# EAGLE design Adafruit MatrixPortal S3 (EAGLE 9.6.2)
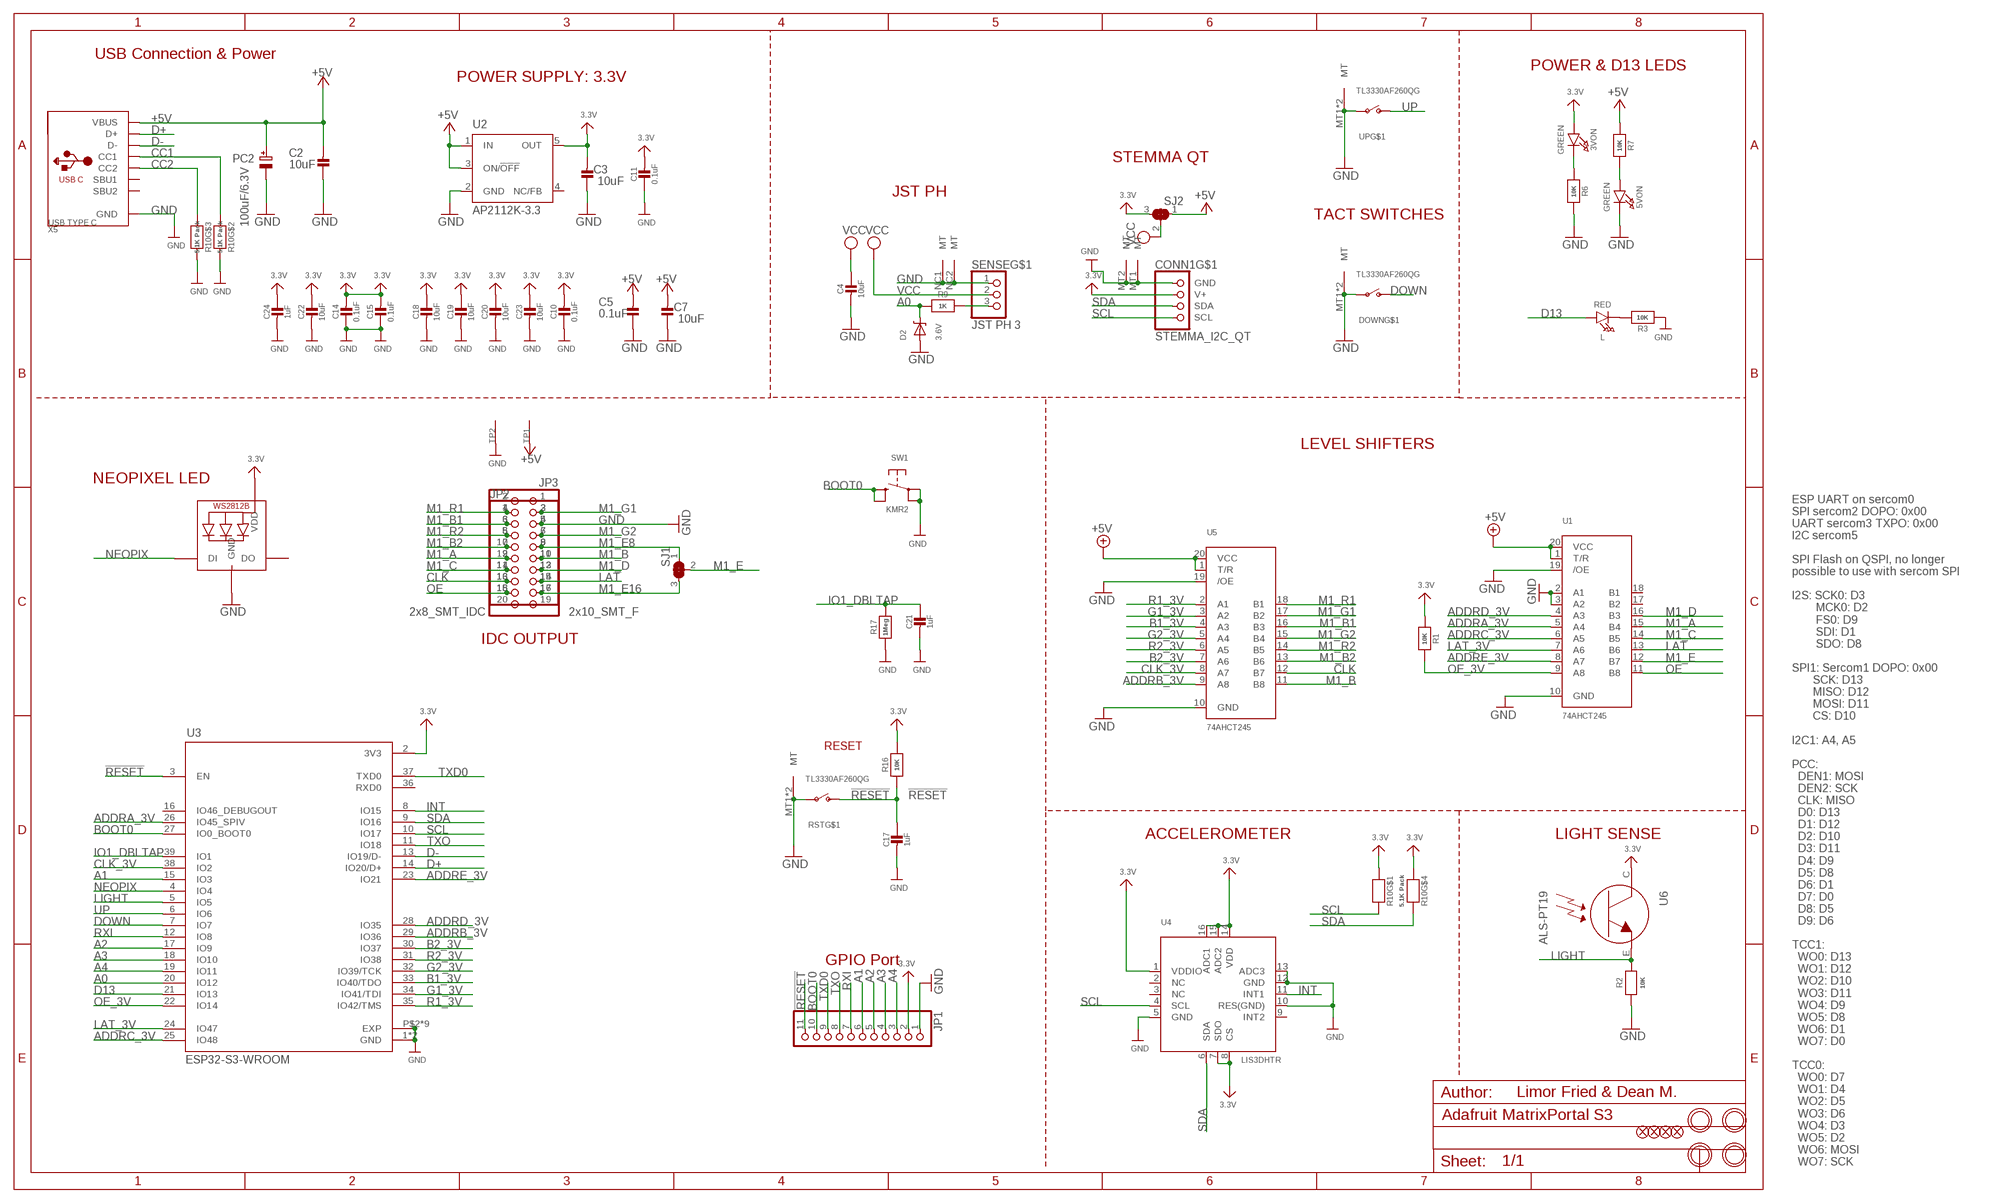
[diagram p0: schematic, sheet 1]

## Parts
3VON  GREEN  LED0603_NOOUTLINE  [CHIPLED_0603_NOOUTLINE]
5VON  GREEN  LED0603_NOOUTLINE  [CHIPLED_0603_NOOUTLINE]
C2  10uF  CAP_CERAMIC0805-NOOUTLINE  [0805-NO]
C3  10uF  CAP_CERAMIC0805-NOOUTLINE  [0805-NO]
C4  10uF  CAP_CERAMIC0805-NOOUTLINE  [0805-NO]
C5  0.1uF  CAP_CERAMIC0603_NO  [0603-NO]
C7  10uF  CAP_CERAMIC0805-NOOUTLINE  [0805-NO]
C10  0.1uF  CAP_CERAMIC0603_NO  [0603-NO]
C11  0.1uF  CAP_CERAMIC0603_NO  [0603-NO]
C14  0.1uF  CAP_CERAMIC0603_NO  [0603-NO]
C15  0.1uF  CAP_CERAMIC0603_NO  [0603-NO]
C17  1uF  CAP_CERAMIC0603_NO  [0603-NO]
C18  10uF  CAP_CERAMIC0805-NOOUTLINE  [0805-NO]
C19  10uF  CAP_CERAMIC0805-NOOUTLINE  [0805-NO]
C20  10uF  CAP_CERAMIC0805-NOOUTLINE  [0805-NO]
C21  1uF  CAP_CERAMIC0603_NO  [0603-NO]
C22  10uF  CAP_CERAMIC0805-NOOUTLINE  [0805-NO]
C23  10uF  CAP_CERAMIC0805-NOOUTLINE  [0805-NO]
C24  1uF  CAP_CERAMIC0603_NO  [0603-NO]
CONN1  STEMMA_I2C_QT  [JST_SH4]
D2  3.6V  DIODE-ZENERSOD323  [SOD-323]
DOWN  TL3330AF260QG  SWITCH_SPST_MNT_TACT_RA  [SPST_TACTILE_RA]
FID1  FIDUCIAL_1MM  [FIDUCIAL_1MM]
FID2  FIDUCIAL_1MM  [FIDUCIAL_1MM]
FID3  FIDUCIAL_1MM  [FIDUCIAL_1MM]
FID4  FIDUCIAL_1MM  [FIDUCIAL_1MM]
JP1  HEADER-1X11  [1X11_ROUND]
JP2  2x8_SMT_IDC  HEADER-2X8_SHROUDEDSMT  [2X08_SHROUDEDSMT]
JP3  2x10_SMT_F  HEADER-2X10SMT_FEMALE  [2X10_SMT_FEMALE]
L  RED  LED0603_NOOUTLINE  [CHIPLED_0603_NOOUTLINE]
LED1  WS2812B_3535FULL  [LED3535_FULLPADS]
PC2  100uF/6.3V  CAP_ELECTROLYTICPANASONIC_D  [PANASONIC_D]
R1  10K  RESISTOR_0603_NOOUT  [0603-NO]
R2  10K  RESISTOR_0603_NOOUT  [0603-NO]
R3  10K  RESISTOR_0603_NOOUT  [0603-NO]
R6  10K  RESISTOR_0603_NOOUT  [0603-NO]
R7  10K  RESISTOR_0603_NOOUT  [0603-NO]
R9  1K  RESISTOR_0603_NOOUT  [0603-NO]
R10  5.1K Pack  RESISTOR_4PACK  [RESPACK_4X0603]
R16  10K  RESISTOR_0603_NOOUT  [0603-NO]
R17  1Meg  RESISTOR_0603_NOOUT  [0603-NO]
RST  TL3330AF260QG  SWITCH_SPST_MNT_TACT_RA  [SPST_TACTILE_RA]
SENSE  JST PH 3  CON_JST_PH_3PIN  [JSTPH3]
SJ1  SOLDERJUMPER_2WAY  [SOLDERJUMPER_2WAY_OPEN_NOPASTE]
SJ2  SOLDERJUMPER_2WAY  [SOLDERJUMPER_2WAY_OPEN_NOPASTE]
SW1  KMR2  SWITCH_TACT_SMT_RKB2  [BTN_RKB2_4.6X2.8]
TP1  SEWTAP_SMTNUTM3  [SMT_NUT_3MM]
TP2  SEWTAP_SMTNUTM3  [SMT_NUT_3MM]
U1  74AHCT245  74LCX245_TSSOP20  [TSSOP20]
U2  AP2112K-3.3  LP2985-XXDBVR33  [SOT23-DBV]
U3  ESP32-S3-WROOM  [S3-WROOM32]
U4  LIS3DHTR  ACCEL_LIS3DHTR  [LGA16_3X3MM]
U5  74AHCT245  74LCX245_TSSOP20  [TSSOP20]
U6  ALS-PT19  PHOTOTRANSISTOR_PT19-315C  [ALS-PT19-315C]
U$14  MOUNTINGHOLE2.5  [MOUNTINGHOLE_2.5_PLATED]
U$19  MOUNTINGHOLE2.5  [MOUNTINGHOLE_2.5_PLATED]
U$22  MOUNTINGHOLE2.5  [MOUNTINGHOLE_2.5_PLATED]
U$24  MOUNTINGHOLE2.5  [MOUNTINGHOLE_2.5_PLATED]
UP  TL3330AF260QG  SWITCH_SPST_MNT_TACT_RA  [SPST_TACTILE_RA]
X5  USB TYPE C  USB_C  [USB_C_CUSB31-CFM2AX-01-X]

## Nets
3.3V: 3VON.A C3.2 C10.2 C11.2 C14.2 C15.2 C18.1 C19.1 C20.1 C22.1 C23.1 C24.1 CONN1.2(V+) JP1.2 LED1.2(VDD) R1.1 R10.1 R10.4 R16.2 SJ2.3 U2.5(OUT) U3.2(3V3) U4.1(VDDIO) U4.7(SDO) U4.8(CS) U4.14(VDD) U4.15(ADC2) U4.16(ADC1) U6.C
!RESET: C17.1 JP1.11 R16.1 RST.2(S) U3.3(EN)
+5V [usbvcc]: C2.2 C5.2 C7.2 PC2.+ R7.1 SJ2.1 TP1.P$1(SEW) U1.1(T/R) U1.20(VCC) U2.1(IN) U2.3(ON/!OFF) U5.1(T/R) U5.20(VCC) X5.A4B9(VBUS) X5.B4A9(VBUS)
A0: D2.C R9.2 U3.20(IO12)
A0_JST: R9.1 SENSE.3
A1: JP1.6 U3.15(IO3)
A2: JP1.5 U3.17(IO9)
A3: JP1.4 U3.18(IO10)
A4: JP1.3 U3.19(IO11)
ADDRA_3V: U1.5(A4) U3.26(IO45_SPIV)
ADDRB_3V: U3.29(IO36) U5.9(A8)
ADDRC_3V: U1.6(A5) U3.25(IO48)
ADDRD_3V: U1.4(A3) U3.28(IO35)
ADDRE_3V: U1.8(A7) U3.23(IO21)
B1_3V: U3.33(IO40/TDO) U5.4(A3)
B2_3V: U3.30(IO37) U5.7(A6)
BOOT0: JP1.10 SW1.B'(S1) SW1.B(S) U3.27(IO0_BOOT0)
CC1: R10.2 X5.A5(CC1)
CC2: R10.3 X5.B5(CC2)
CLK: JP2.13 JP3.16 U5.12(B7)
CLK_3V: U3.38(IO2) U5.8(A7)
D13: L.A U3.21(IO13)
D+: U3.14(IO20/D+) X5.A6(D+) X5.B6(D+)
D-: U3.13(IO19/D-) X5.A7(D-) X5.B7(D-)
DOWN: DOWN.2(S) U3.7(IO7)
G1_3V: U3.34(IO41/TDI) U5.3(A2)
G2_3V: U3.32(IO39/TCK) U5.5(A4)
GND [lowpower]: 5VON.C C2.1 C3.1 C4.2 C5.1 C7.1 C10.1 C11.1 C14.1 C15.1 C17.2 C18.2 C19.2 C20.2 C21.2 C22.2 C23.2 C24.2 CONN1.1(GND) CONN1.MT1(MT) CONN1.MT2(MT) D2.A DOWN.1(P) DOWN.MT1(MT) DOWN.MT2(MT) JP1.1 JP2.4 JP3.5 LED1.4(GND) PC2.- R2.2 R3.2 R6.2 R10.6 R10.7 R17.1 RST.1(P) RST.MT1(MT) RST.MT2(MT) SENSE.1 SENSE.NC1(MT) SENSE.NC2(MT) SW1.A'(P1) SW1.A(P) TP2.P$1(SEW) U1.2(A1) U1.3(A2) U1.10(GND) U1.19(/OE) U2.2(GND) U3.1(GND) U3.40(GND) U3.P$2(EXP) U3.P$3(EXP) U3.P$4(EXP) U3.P$5(EXP) U3.P$6(EXP) U3.P$7(EXP) U3.P$8(EXP) U3.P$9(EXP) U3.P$10(EXP) U4.5(GND) U4.10(RES(GND)) U4.12(GND) U4.13(ADC3) U5.10(GND) U5.19(/OE) UP.1(P) UP.MT1(MT) UP.MT2(MT) X5.A1B12(GND) X5.B1A12(GND)
INT: U3.8(IO15) U4.11(INT1)
IO1_DBLTAP: C21.1 R17.2 U3.39(IO1)
LAT: JP2.14 JP3.15 U1.13(B6)
LAT_3V: U1.7(A6) U3.24(IO47)
LIGHT: R2.1 U3.5(IO5) U6.E
M1_A: JP2.9 JP3.12 U1.15(B4)
M1_B: JP2.10 JP3.11 U5.11(B8)
M1_B1: JP2.3 JP3.6 U5.16(B3)
M1_B2: JP2.7 JP3.10 U5.13(B6)
M1_C: JP2.11 JP3.14 U1.14(B5)
M1_D: JP2.12 JP3.13 U1.16(B3)
M1_E: SJ1.2 U1.12(B7)
M1_E8: JP2.8 JP3.9 SJ1.1
M1_E16: JP2.16 JP3.17 SJ1.3
M1_G1: JP2.2 JP3.3 U5.17(B2)
M1_G2: JP2.6 JP3.7 U5.15(B4)
M1_R1: JP2.1 JP3.4 U5.18(B1)
M1_R2: JP2.5 JP3.8 U5.14(B5)
N$1: 5VON.A R7.2
N$2: 3VON.C R6.1
N$5: L.C R3.1
NEOPIX: LED1.1(DI) U3.4(IO4)
OE: JP2.15 JP3.18 U1.11(B8)
OE_3V: R1.2 U1.9(A8) U3.22(IO14)
R1_3V: U3.35(IO42/TMS) U5.2(A1)
R2_3V: U3.31(IO38) U5.6(A5)
RXI: JP1.7 U3.12(IO8)
SCL: CONN1.4(SCL) R10.8 U3.10(IO17) U4.4(SCL)
SDA: CONN1.3(SDA) R10.5 U3.9(IO16) U4.6(SDA)
TXD0: JP1.9 U3.37(TXD0)
TXO: JP1.8 U3.11(IO18)
UP: U3.6(IO6) UP.2(S)
VCC [power]: C4.1 SENSE.2 SJ2.2
Unconnected: JP3.1 JP3.2 JP3.19 JP3.20 LED1.3(DO) U1.17(B2) U1.18(B1) U2.4(NC/FB) U3.16(IO46_DEBUGOUT) U3.36(RXD0) U4.2(NC) U4.3(NC) U4.9(INT2) X5.A8(SBU1) X5.B8(SBU2)

## Notes on the sheet
- USB Connection & Power
- POWER & D13 LEDS
- POWER SUPPLY: 3.3V
- STEMMA QT
- JST PH
- TACT SWITCHES
- LEVEL SHIFTERS
- NEOPIXEL LED
- IDC OUTPUT
- RESET
- ACCELEROMETER | LIGHT SENSE
- GPIO Port
- Limor Fried & Dean M.
- ESP UART on sercom0
  SPI sercom2 DOPO: 0x00
  UART sercom3 TXPO: 0x00
  I2C sercom5
  
  SPI Flash on QSPI, no longer
  possible to use with sercom SPI
  
  I2S: SCK0: D3
          MCK0: D2
          FS0: D9
          SDI: D1
          SDO: D8
  
  SPI1: Sercom1 DOPO: 0x00
         SCK: D13
         MISO: D12
         MOSI: D11
         CS: D10
  
  I2C1: A4, A5
  
  PCC:
    DEN1: MOSI
    DEN2: SCK
    CLK: MISO
    D0: D13
    D1: D12
    D2: D10
    D3: D11
    D4: D9
    D5: D8
    D6: D1
    D7: D0
    D8: D5
    D9: D6
  
  TCC1:
    WO0: D13
    WO1: D12
    WO2: D10
    WO3: D11
    WO4: D9
    WO5: D8
    WO6: D1
    WO7: D0
  
  TCC0:
    WO0: D7
    WO1: D4
    WO2: D5
    WO3: D6
    WO4: D3
    WO5: D2
    WO6: MOSI
    WO7: SCK

## Library data of the parts
3VON 5VON L = microbuilder:LED: LED 0603 - 0603 Surface Mount Package 2mA: Green LED - Low Power (3.9mcd, 2ma, 1.7Vf) - Digikey: 475-2709-2-ND Orange LED - Low Power (9.8mcd, 2ma, 1.8Vf) - Digikey: 475-1194-2-ND Red LED - Low Power (5mcd, 2ma, 1.8Vf) - Digikey: 475-1195-2-ND Yellow LED - Low Power (7mcd, 2ma, 1.8Vf) - Digikey: 475-1196-2-ND 5mA: Blue LED - Low Power (17mcd, 5ma, 2.9Vf) - Digikey: LNJ937W8CRACT-ND 0805 - 0805 Surface Mount Package 2mA: Red LED (8.8mcd, 2mA, 1.8Vf, Clear) - Low Power [Digikey: 475-2510-1-ND] Green LED (5mcd, 2mA, 1.8Vf, Clear) - Low Power [Digikey: 475-2730-1-ND] Yellow LED (11.3mcd, 2mA, 1.8Vf, Clear) - Low Power [Digikey: 475-2555-1-ND] 20mA: Red LED (104mcd, 20mA, Diffused) - LS R976 [Digikey: 475-1278-6-ND] Red LED (12mcd, 20mA, 2.0Vf, Clear) - APT2012EC [Digikey: 754-1128-1-ND] Green LED (15mcd, 20mA, 2.2Vf, Clear) - APT2012GC [Digikey: 754-1131-1-ND] Orange LED (160mcd, 20mA, 2.1Vf, Clear) - APT2012SECK [Digikey: 754-1130-1-ND] 1206 - 1206 Surface Mount Package Green LED (26mcd, 20mA, Diffused) - LG N971 [Digikey: 475-1407-6-ND] Red LED (15mcd, 20mA, Diffused) - LH N974 [Digikey: 475-1416-6-ND] Cree - Cree High-Power Surface Mount LEDs XPEBWT-L1-0000-00D50 - White 111lm 350mA 2.9Vf 6200K 110° XTEAWT-00-0000-00000LEE3 - White 114lm 350mA 2.85Vf 5000K 115° Everlight - Everlight 45-21 Series Surface Mount LEDs 45-21/QK2C-B2832AC2CB2/2T - Warm White 2000mcd 20mA 3.25Vf 3050K 120° 45-21/LK2C-B38452C4CB2/2T - Nuetral White 2000mcd 20mA 3.25Vf 4150K 120° 45-21/LK2C-B50634C6CB2/2T - Cold White 2200mcd 20mA 3.25Vf 5650K 120° PLCC2 Reverse Mount LS T77K-J1L2-1-0-2-R18-Z - Red 11.25mcd 2mA 1.8Vf 630nm 120° LO T77K-L1M2-24-Z - Orange 19.6mcd 2mA 1.8Vf 606nm 120° LY T77K-K2M1-26-Z - Yellow 15.7mcd 2mA 1.8Vf 587nm 120°; ROT: 270
C2-C5 C7 C10 C11 C14 C15 C17-C24 = microbuilder:CAP_CERAMIC: Ceramic Capacitors For new designs, use the packages preceded by an '_' character since they are more reliable: The following footprints should be used on most boards: _0402 - Standard footprint for regular board layouts _0603 - Standard footprint for regular board layouts _0805 - Standard footprint for regular board layouts _1206 - Standard footprint for regular board layouts For extremely tight-pitch boards where space is at a premium, the following 'micro-pitch' footprints can be used (smaller pads, no silkscreen outline, etc.): _0402MP - Micro-pitch footprint for very dense/compact boards _0603MP - Micro-pitch footprint for very dense/compact boards _0805MP - Micro-pitch footprint for very dense/compact boards _1206MP - Micro-pitch footprint for very dense/compact boards
CONN1 = adafruit_electromech:STEMMA_I2C; LCSC: C2845363
D2 = microbuilder:DIODE-ZENER: Zener Diode SMA: 30V 1W Zener Diode, 1.2Vf - Digikey: SMAZ30-FDICT-ND
DOWN RST UP = adafruit_electromech:SWITCH_SPST_MNT: Switch - SPST 4UCon 19192 (6.7x2.6mm SMT); LCSC: C778159
FID1-FID4 = microbuilder:FIDUCIAL: Fiducial Alignment Points Various fiducial points for machine vision alignment.; BOM: EXCLUDE
JP1 = microbuilder:HEADER-1X11
JP2 = microbuilder:HEADER-2X8
JP3 = microbuilder:HEADER-2X10: PIN HEADER SMT_MALE: 4U 17654 SMT_FEMALE - 4UConnector: 03587
LED1 = microbuilder:WS2812B
PC2 = microbuilder:CAP_ELECTROLYTIC: Electrolytic Capacitors SMT PANASONIC_C - Size C Panasonic Electrolytic Aluminum Capacitor 47µF 16V 20% Electrolytic Capacitor [Digikey: PCE3890TR-ND] PANASONIC_D - Size D Panasonic Electrolytic Aluminum Capacitor 100µF 25V 20% Electrolytic Capacitor [Digikey: PCE3898TR-ND] PTH 3.5 mm grid, 8 mm diameter ... 3.5 mm grid, 10 mm diameter ...
R1-R3 R6 R7 R9 R16 R17 = microbuilder:RESISTOR: Resistors For new designs, use the packages preceded by an '_' character since they are more reliable: The following footprints should be used on most boards: _0402 - Standard footprint for regular board layouts _0603 - Standard footprint for regular board layouts _0805 - Standard footprint for regular board layouts _1206 - Standard footprint for regular board layouts For extremely tight-pitch boards where space is at a premium, the following 'micro-pitch' footprints can be used (smaller pads, no silkscreen outline, etc.): _0402MP - Micro-pitch footprint for very dense/compact boards _0603MP - Micro-pitch footprint for very dense/compact boards _0805MP - Micro-pitch footprint for very dense/compact boards _1206MP - Micro-pitch footprint for very dense/compact boards
R10 = microbuilder:RESISTOR_4PACK: Resistor Packs (4 resistors) 4 x 0603 10K 1/16W - Digikey: YC164J-10KCT-ND
SENSE = adafruit_electromech:CON_JST_PH_3PIN
SJ1 SJ2 = microbuilder:SOLDERJUMPER_2WAY: 2-Way Solder Jumper
SW1 = adafruit_electromech:SWITCH_TACT_SMT: SMT Tact Switches RKB2 https://www.digikey.com/short/m027prz5
TP1 TP2 = adafruit_electromech:SEWTAP; FORCETHM: 1
U1 U5 = microbuilder:74LCX245: 74LCX245MTC - 5.0V Tolerant Bi-Directional Buffer Can be used to interface 5.0V logic to 2.5 or 3.3V devices Digikey: 74LCX245MTCXTR-ND Mouser: 512-74LCX245MTCX
U2 = SmartPrj:LP2985-XXDBVR: ULTRALOW-POWER 50-mA LOW-DROPOUT LINEAR REGULATORS 50-mA Low-Dropout Regulator Source: http://focus.ti.com/lit/ds/symlink/tps77001.pdf
U3 = adafruit_wireless:ESP32-S3-WROOM: WiFi 802.11b/g/n Transceiver Module 2.4GHz Antenna Not Included Surface Mount Check prices <https://snapeda.com/parts/ESP32-S2-WROVER/Espressif%20Systems/view-part/?ref=eda>
U4 = adafruit_sensor:ACCEL_LIS3DHTR: LIS3DHTR 3-Axis Accelerometer with I2C/SPI Interface VDD: 1.71-3.6V VDDIO: 1.71-VDD+0.1V Scale: +/-2g, 4g, 8g, 16g with 16--bit data output Temp:: -40°C - 85°C Mouser: 511-LIS3DHTR Digikey: 497-10613-1-ND
U6 = microbuilder:PHOTOTRANSISTOR: ALS-PT19-315C - Analog Light Sensor VCC: 2.5-5.5V; LCSC: C146233
U$14 U$19 U$22 U$24 = adafruit_electromech:MOUNTINGHOLE: Mounting Hole For #2 screws (0.086"/2.18mm width, 0.094"/2.4mm hole) use 2.5mm; BOM: EXCLUDE
X5 = adafruit_electromech:USB_C: USB Type-C USB 2.0 Connector; LCSC: C165948

## Net classes
1 power: width 0.305 mm
2 lowpower: width 0.305 mm, drill 0.483 mm

## Board
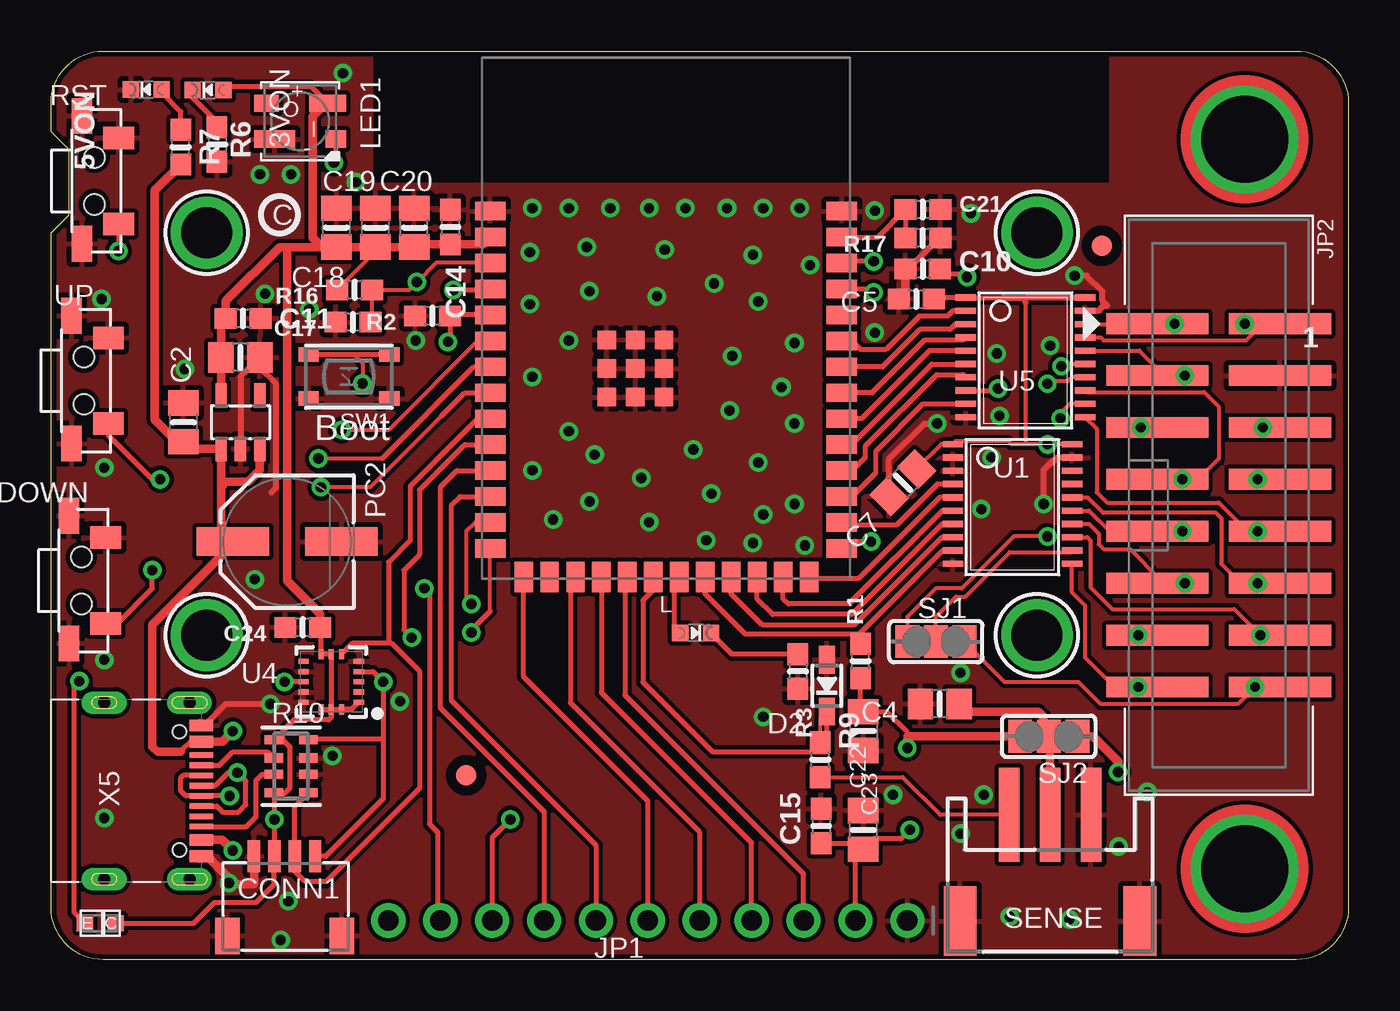
[diagram p1: board, top side]
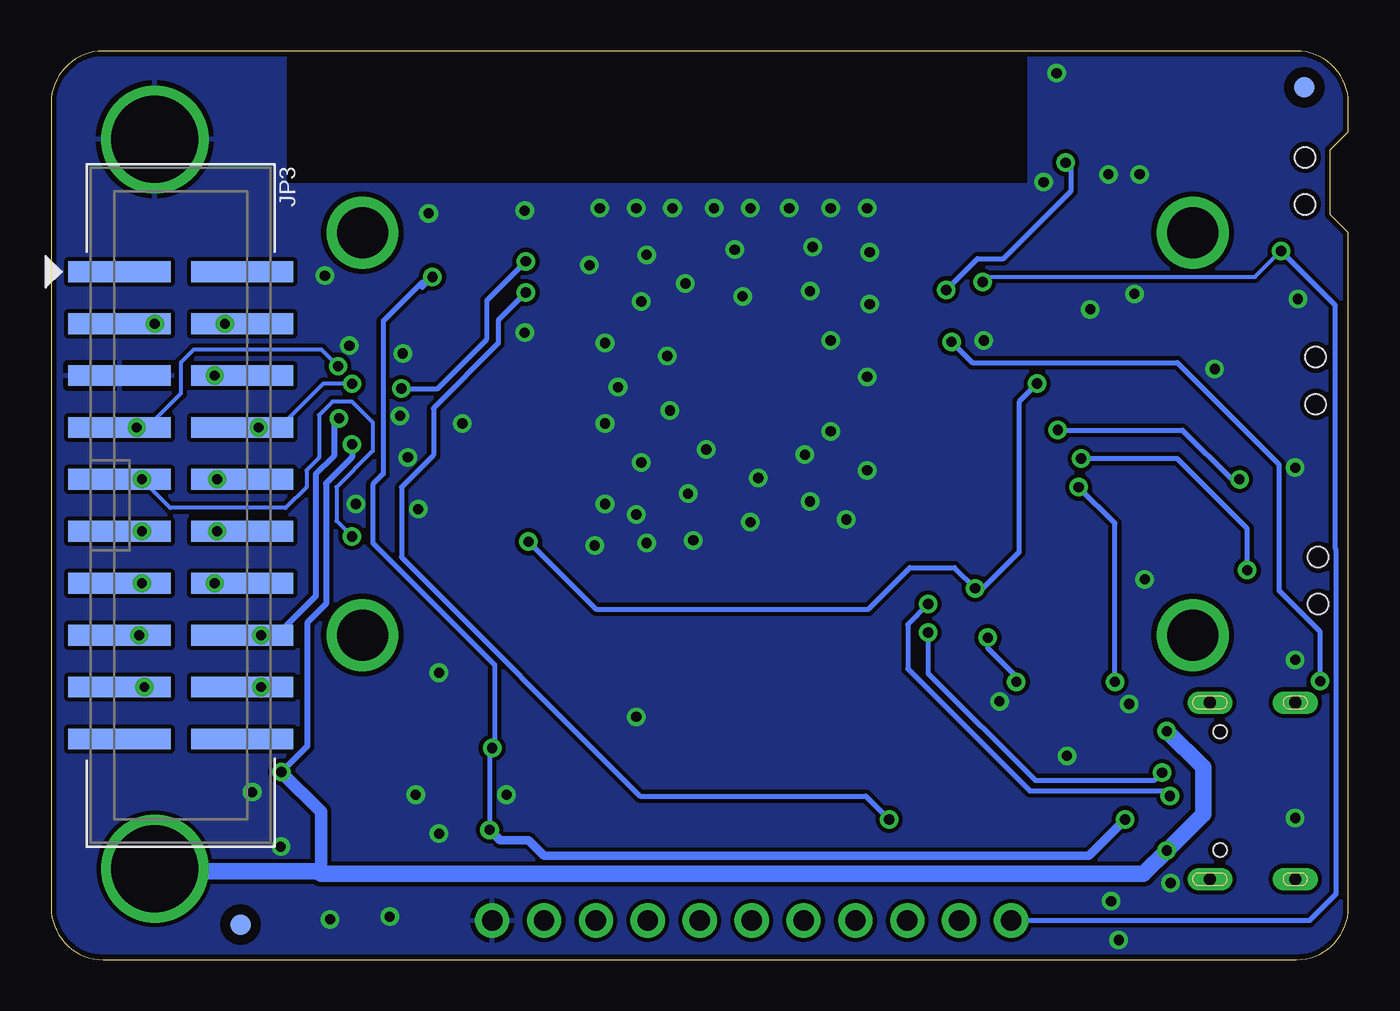
[diagram p2: board, bottom side, seen from below]

Size 63.5 x 44.45 mm. Coordinates in mm from the lower left corner, seen from the top.
Outline: 63.5,41.91 63.5,2.54 arc-90 60.96,0 2.54,0 arc-90 0,2.54 0,35.56 0.89,36.45 0.89,39.62 0,40.51 0,41.91 arc-90 2.54,44.45 60.96,44.45 arc-90 63.5,41.91
Copper layers (1*16): Top 0.035mm / dielectric 1.5mm / Bottom 0.035mm
Design rules "adafruit *": minimum track width 8mil, minimum drill 15.5mil, track to track 8mil, track to pad 8mil, pad to pad 8mil, via to via 8mil, smd to smd 8mil, copper to edge 10mil, drill to drill 8mil, minimum pad ring 10mil, minimum via ring 8mil, stop-mask expansion 2mil, vias tented up to drill 20mil, thermal gap 10mil

### Footprints (pad centres in the part's own frame; a part is rotated, then mirrored left to right if it is on the bottom)
CHIPLED_0603_NOOUTLINE = smd 0.8 x 0.8: A 0,-0.75; C 0,0.75
0805-NO = smd 1.24 x 1.5: 1 -0.95,0; 2 0.95,0
0603-NO = smd 1.075 x 1: 1 -0.85,0; 2 0.85,0
JST_SH4 = smd 0.6 x 1.55: 1 -1.5,2.006; 2 -0.5,2.006; 3 0.5,2.006; 4 1.5,2.006 | smd 1.2 x 1.8: MT1 -2.8,-1.894; MT2 2.8,-1.894
SOD-323 = smd 1.35 x 0.8: A 1.27,0; C -1.27,0
SPST_TACTILE_RA = smd 1.1 x 1.5: 1 2.1,-0.9; 2 -2.1,-0.9 | smd 1.75 x 1: MT1 3.175,0.9; MT2 -3.075,0.9 | hole 1: 1.15,0.3; -1.15,0.3
FIDUCIAL_1MM = smd 1 x 1: 1 0,0
1X11_ROUND = drill 1 pad 1.676: 1 -12.7,0; 2 -10.16,0; 3 -7.62,0; 4 -5.08,0; 5 -2.54,0; 6 0,0; 7 2.54,0; 8 5.08,0; 9 7.62,0; 10 10.16,0; 11 12.7,0
2X08_SHROUDEDSMT = smd 1.02 x 5: 1 -8.89,-3; 2 -8.89,3; 3 -6.35,-3; 4 -6.35,3; 5 -3.81,-3; 6 -3.81,3; 7 -1.27,-3; 8 -1.27,3; 9 1.27,-3; 10 1.27,3; 11 3.81,-3; 12 3.81,3; 13 6.35,-3; 14 6.35,3; 15 8.89,-3; 16 8.89,3
2X10_SMT_FEMALE = smd 1.02 x 5: 1 -11.43,-3; 2 -11.43,3; 3 -8.89,-3; 4 -8.89,3; 5 -6.35,-3; 6 -6.35,3; 7 -3.81,-3; 8 -3.81,3; 9 -1.27,-3; 10 -1.27,3; 11 1.27,-3; 12 1.27,3; 13 3.81,-3; 14 3.81,3; 15 6.35,-3; 16 6.35,3; 17 8.89,-3; 18 8.89,3; 19 11.43,-3; 20 11.43,3
LED3535_FULLPADS = smd 1 x 0.85: 1 -1.75,0.875 | smd 1.8 x 0.85: 2 -1.35,-0.875 | smd 1.2 x 0.85: 3 1.65,-0.875 | smd 2 x 0.85: 4 1.25,0.875
PANASONIC_D = smd 3.556 x 1.4: + 2.654,0; - -2.654,0
RESPACK_4X0603 = smd 0.45 x 0.9: 1 -1.3,-0.85; 2 -0.4,-0.85; 3 0.4,-0.85; 4 1.3,-0.85; 5 1.3,0.85; 6 0.4,0.85; 7 -0.4,0.85; 8 -1.3,0.85
JSTPH3 = smd 1 x 4.6: 1 -2,-2.7; 2 0,-2.7; 3 2,-2.7 | smd 1.6 x 3.4: NC1 -4.4,2.5; NC2 4.4,2.5
SOLDERJUMPER_2WAY_OPEN_NOPASTE = smd 1.168 x 1.6: 1 -1.397,0; 2 0,0; 3 1.397,0
BTN_RKB2_4.6X2.8 = smd 1 x 0.7: A 1.973,1.075; A' -1.973,1.075; B 1.973,-1.075; B' -1.973,-1.075
SMT_NUT_3MM = drill 4.25 pad 4.572: P$1 0,0
TSSOP20 = smd 0.305 x 0.991: 1 -2.925,-2.918; 2 -2.275,-2.918; 3 -1.625,-2.918; 4 -0.975,-2.918; 5 -0.325,-2.918; 6 0.325,-2.918; 7 0.975,-2.918; 8 1.625,-2.918; 9 2.275,-2.918; 10 2.925,-2.918; 11 2.925,2.918; 12 2.275,2.918; 13 1.625,2.918; 14 0.975,2.918; 15 0.325,2.918; 16 -0.325,2.918; 17 -0.975,2.918; 18 -1.625,2.918; 19 -2.275,2.918; 20 -2.925,2.918
SOT23-DBV = smd 0.55 x 1.2: 1 -0.95,-1.3; 2 0,-1.3; 3 0.95,-1.3; 4 0.95,1.3; 5 -0.95,1.3
S3-WROOM32 = smd 1.5 x 0.9: 1 -8.6,9.064; 2 -8.6,7.794; 3 -8.6,6.524; 4 -8.6,5.254; 5 -8.6,3.984; 6 -8.6,2.714; 7 -8.6,1.444; 8 -8.6,0.174; 9 -8.6,-1.096; 10 -8.6,-2.366; 11 -8.6,-3.636; 12 -8.6,-4.906; 13 -8.6,-6.176; 14 -8.6,-7.446; 27 8.6,-7.446; 28 8.6,-6.176; 29 8.6,-4.906; 30 8.6,-3.636; 31 8.6,-2.366; 32 8.6,-1.096; 33 8.6,0.174; 34 8.6,1.444; 35 8.6,2.714; 36 8.6,3.984; 37 8.6,5.254; 38 8.6,6.524; 39 8.6,7.794; 40 8.6,9.064 | smd 0.9 x 1.5: 15 -6.97,-8.836; 16 -5.7,-8.836; 17 -4.43,-8.836; 18 -3.16,-8.836; 19 -1.89,-8.836; 20 -0.62,-8.836; 21 0.65,-8.836; 22 1.92,-8.836; 23 3.19,-8.836; 24 4.46,-8.836; 25 5.73,-8.836; 26 7,-8.836 | smd 0.9 x 0.9: P$2 -2.9,2.76; P$3 -2.9,1.36; P$4 -2.9,-0.04; P$5 -1.5,-0.04; P$6 -1.5,1.36; P$7 -1.5,2.76; P$8 -0.1,2.76; P$9 -0.1,1.36; P$10 -0.1,-0.04
LGA16_3X3MM = smd 0.5 x 0.25: 1 -1.35,1; 2 -1.35,0.5; 3 -1.35,0; 4 -1.35,-0.5; 5 -1.35,-1; 9 1.35,-1; 10 1.35,-0.5; 11 1.35,0; 12 1.35,0.5; 13 1.35,1 | smd 0.25 x 0.5: 6 -0.5,-1.35; 7 0,-1.35; 8 0.5,-1.35; 14 0.5,1.35; 15 0,1.35; 16 -0.5,1.35
ALS-PT19-315C = smd 0.8 x 0.8: C -0.75,0; E 0.75,0
MOUNTINGHOLE_2.5_PLATED = drill 2.5 pad 3.2: P$1 0,0
USB_C_CUSB31-CFM2AX-01-X = smd 0.575 x 1.15: A1B12 -3.2,2.275; A4B9 -2.4,2.275; B1A12 3.2,2.275; B4A9 2.4,2.275 | smd 0.275 x 1.15: A5 -1.25,2.275; A6 -0.25,2.275; A7 0.25,2.275; A8 1.25,2.275; B5 1.75,2.275; B6 0.75,2.275; B7 -0.75,2.275; B8 -1.75,2.275 | drill 0.6 pad 1 long: M1 -4.32,1.7; M2 4.32,1.7; M3 -4.32,-2.48; M4 4.32,-2.48 | hole 0.65: 2.89,1.2; -2.89,1.2

### Placement (x,y rotation side)
3VON  7.68,42.55 90 top
5VON  4.66,42.57 90 top
C2  6.48,26.29 270 top
C3  9.27,29.46 180 top
C4  43.5,12.51 180 top
C5  42.35,32.32 0 top
C7  41.69,23.33 45 top
C10  42.66,33.8 0 top
C11  9.4,31.37 180 top
C14  19.54,35.84 270 top
C15  37.69,6.53 270 top
C17  14.78,31.19 180 top
C18  13.97,35.81 90 top
C19  15.88,35.81 90 top
C20  17.78,35.81 90 top
C21  42.67,36.7 0 top
C22  39.75,6.35 90 top
C23  39.75,11.18 270 top
C24  12.32,16.26 180 top
CONN1  11.43,3.05 0 top
D2  37.97,13.4 90 top
DOWN  1.78,18.54 90 top
FID1  20.32,9.02 0 top
FID2  51.44,34.92 0 top
FID3  54.23,1.71 0 bottom
FID4  2.16,42.67 0 bottom
JP1  29.21,1.91 180 top
JP2  57.15,22.23 270 top
JP3  57.15,22.23 270 bottom
L  31.55,15.98 270 top
LED1  12.19,41.02 180 top
PC2  11.56,20.45 180 top
R1  39.62,14.61 90 top
R2  18.67,31.5 180 top
R3  36.55,14.1 270 top
R6  8.13,39.88 270 top
R7  6.35,39.75 90 top
R9  37.66,9.78 90 top
R10  11.75,9.46 270 top
R16  14.86,32.77 180 top
R17  42.67,35.31 180 top
RST  2.41,38.1 90 top
SENSE  48.9,4.38 180 top
SJ1  43.31,15.56 0 top
SJ2  48.83,10.92 180 top
SW1  14.58,28.52 180 top
TP1  58.42,4.45 0 top
TP2  58.42,40.13 0 top
U1  47.05,22.29 270 top
U2  9.27,26.29 0 top
U3  30.1,27.56 0 top
U4  13.72,13.59 180 top
U5  47.69,29.46 270 top
U6  2.41,1.78 180 top
U$14  7.62,15.88 0 top
U$19  7.62,35.56 0 top
U$22  48.26,35.56 0 top
U$24  48.26,15.88 0 top
U$25  [S3_MATRIXPORTAL_TOP]  0,0 0 top
U$26  [S3_MATRIXPORTAL_BOT]  63.5,0 0 bottom
U$44  [PCBFEAT-REV-040]  11.18,36.45 0 top
UP  1.91,28.32 90 top
X5  5.08,8.26 270 top

### Tracks (layer width: path | path; a pad name or v marks a point on that pad's centre or on a via)
3.3V  (via drill 0.5)
  Top 0.203: R16.2 16.02,34.78 17.69,34.78 C20.1
  Top 0.254: 3VON.A 8.61,42.72 12.71,42.72 13.49,41.94 LED1.2 | R10.4 10.93,8.13 | 10.93,8.13 v10.93,6.86 CONN1.2 10.93,3.69 10.03,2.79 8,2.79 6.99,1.78 U6.C | R10.1 11.34,10.76 | 11.34,10.76 11.68,10.41 11.68,8.38 11.43,8.13 10.93,8.13 | U4.15 13.72,11.86 13.59,11.73 11.89,11.73 11.34,11.18 11.34,10.76 | U4.14 U4.15 | U4.15 U4.16 14.72,12.24 U4.1 | C15.2 39.47,5.68 39.59,5.56 | 39.59,5.56 C22.1 40.26,5.91 41.59,5.91 v42.04,6.35 | JP1.2 39.37,5.33 39.59,5.56 | v41.91,10.35 41.91,11.11 40.89,12.13 C23.1 39.62,12.25 R1.1 | C10.2 43.77,33.54 44.69,33.54 v44.83,33.4 | U4.15 U4.7 U4.8 13.22,16.21 C24.1
  Top 0.406: SJ2.3 41.91,10.92 v41.91,10.35 | 13.27,34.86 11.56,34.86 | 11.56,34.86 11.18,34.86 8.55,32.24 C11.2 8.32,31.14 C3.2 U2.5 | 13.27,34.86 C18.1 C19.1 C20.1 17.9,34.99 C14.2 19.56,35.01 21.15,35.01 U3.2 | 13.27,34.86 12.81,35.32 12.81,41.26 13.49,41.94 | 11.56,34.86 11.56,18.54 13.17,16.93 C24.1
  Bottom 0.254: v44.83,33.4 45.34,32.89 45.34,33.15 47.24,31.24 47.24,23.76 47.75,23.25 47.75,20.38 41.78,14.41 41.78,10.48 v41.91,10.35 42.04,10.22 v42.04,6.35
  Bottom 0.406: v42.04,6.35 41.53,5.84 40.13,5.84 39.37,5.08 12.71,5.08 v10.93,6.86
!RESET  (via drill 0.5)
  Top 0.203: U3.3 18.84,34.08 v17.91,33.15 17.53,32.77 R16.1 15.71,31.27 C17.1
  Top 0.254: RST.2 3.31,34.68 v3.3,34.67
  Bottom 0.203: v17.91,33.15 17.65,33.4 4.57,33.4 v3.3,34.67
  Bottom 0.254: JP1.11 1.91,1.91 0.6,3.21 0.6,20.06 0.64,20.09 0.64,32 v3.3,34.67
+5V  (via drill 0.5)
  Top 0.203: 47.69,32.16 47.69,25.24 | 47.69,25.24 46.99,25.24 46.86,25.36 44.29,25.36 U1.1 43.58,25.21 C7.2 | 47.69,25.24 48.74,25.24 v48.77,25.21 48.7,25.21 U1.20
  Top 0.254: 6.35,10.16 6.45,10.26 6.45,10.28 6.83,10.65 X5.A4B9 | C5.2 43.7,32.32 43.77,32.39 U5.1 46.61,32.39
  Top 0.305: U5.20 47.75,32.39 | 46.61,32.39 47.75,32.39 | 47.69,32.16 47.69,32.33 47.75,32.39
  Top 0.406: v52.23,9.18 52.23,9.68 50.99,10.92 SJ2.1 | 8.32,23.11 U2.1 6.83,24.99 C2.2 6.16,25.34 5.08,26.42 5.08,37.63 R7.1 | 8.32,23.11 8.32,21.03 PC2.+ 8.9,20.33 4.95,16.38 4.95,10.41 5.21,10.16 6.35,10.16 | 8.32,23.11 8.57,23.37 9.65,23.37 10.22,23.94 U2.3 | X5.B4A9 8.37,5.86 v8.89,5.33 | X5.A4B9 8.37,10.65 v8.89,11.18
  Bottom 0.305: 50.96,10.45 v52.23,9.18 | v48.77,25.21 48.77,24.57 50.04,23.3 50.04,17.4 50.96,16.48 50.96,10.45 | 50.96,10.45
  Bottom 0.61: 58.55,4.32 TP1.P$1 | 50.29,4.19 50.29,4.32 50.29,7.24 v52.23,9.18
  Bottom 0.813: v8.89,11.18 7.11,9.4 7.11,7.11 v8.89,5.33 10.03,4.19 50.29,4.19 | 58.55,4.32 50.29,4.32
A0
  Top 0.203: R9.2 37.66,11.81 D2.C
  Top 0.254: D2.C 37.97,10.16 32.38,10.16 28.97,13.57 28.97,17.58 29.48,18.09 U3.20
A0_JST
  Top 0.203: SENSE.3 43.53,7.08 41.68,8.93 R9.1
A1
  Top 0.254: U3.15 23.13,13.83 29.21,7.75 JP1.6
A2
  Top 0.254: U3.17 25.41,18.47 25.41,12.56 31.75,6.22 JP1.5
A3
  Top 0.254: U3.18 26.94,13.06 34.29,5.71 JP1.4
A4
  Top 0.254: JP1.3 36.83,4.19 28.08,12.94 28.08,18.6 U3.19
ADDRA_3V
  Top 0.254: U1.5 43.5,22.61 39.52,18.64 37.18,18.64 U3.26
ADDRB_3V
  Top 0.254: U3.29 39.21,22.65 40.35,23.8 40.35,24.86 42.68,27.19 U5.9
ADDRC_3V
  Top 0.254: U1.6 43.62,21.96 39.05,17.4 36.07,17.4 35.83,17.64 U3.25
ADDRD_3V
  Top 0.254: U1.4 43.37,23.26 41.37,21.26 38.83,21.26 U3.28
ADDRE_3V
  Top 0.254: U3.23 33.29,17.89 34.8,16.38 39.33,16.38 43.61,20.66 U1.8
B1_3V
  Top 0.254: U5.4 44.64,30.31 42.76,30.31 40.18,27.73 U3.33
B2_3V
  Top 0.254: U3.30 39.21,23.92 39.84,24.56 39.84,25.11 43.35,28.62 44.64,28.62 U5.7
BOOT0  (via drill 0.5)
  Top 0.203: 14.84,29.6 15.24,29.2 v15.24,28.18
  Top 0.254: SW1.B' 14.84,29.6 SW1.B | v18.27,18.16 18.52,17.91 18.52,6.62 18.92,6.22 18.92,2.03 JP1.10 | v40.13,20.45 39.03,20.45 U3.27
  Bottom 0.254: v15.24,28.18 16.13,27.29 16.13,19.92 17.89,18.16 v18.27,18.16 19.28,19.18 21.46,19.18 23.5,17.14 36.83,17.14 v40.13,20.45
CC1
  Top 0.254: X5.A5 8.23,9.51 8.89,10.16 10.6,10.16 R10.2
CC2
  Top 0.254: X5.B5 9.55,6.5 10.03,6.99 10.03,8.76 10.33,9.06 R10.3
CLK  (via drill 0.48, 0.5)
  Top 0.203: U5.12 49.86,27.19 49.4,26.73 v49.4,26.48 | v53.21,15.88 JP3.16
  Bottom 0.203: JP3.16 v53.21,15.88
  Bottom 0.305: v49.4,26.48 49.66,26.23 49.66,24.64 50.55,23.75 50.55,17.78 52.45,15.88 v53.21,15.88
CLK_3V  (via drill 0.5)
  Top 0.254: U5.8 46.25,27.84 v46.35,27.94 | v40.26,34.16 38.78,34.16 U3.38
  Bottom 0.254: v46.35,27.94 44.58,27.94 42.16,30.35 42.16,32.26 v40.26,34.16
D13
  Top 0.254: U3.21 30.5,18.47 30.5,15.98 L.A
D+  (via drill 0.5)
  Top 0.203: 21.5,17.05 U3.14
  Top 0.254: X5.A6 8.03,8.51 8.67,9.14 v9.12,9.14 9.53,8.74 9.53,7.57 9.17,7.22 8.4,7.22 8.12,7.5 X5.B6 | 21.5,17.05 20.57,16.13 v20.57,16
  Bottom 0.254: v9.12,9.14 9.5,8.76 15.33,8.76 20.57,14 v20.57,16
D-  (via drill 0.5)
  Top 0.203: v20.57,17.4 20.32,17.65 20.32,20.95 20.75,21.38 U3.13
  Top 0.254: v8.74,8 v8.74,8.01 X5.A7 7.35,8.01 6.59,8.01 6.35,8.26 6.35,8.89 6.5,9.04 7.39,9.04 X5.B7
  Bottom 0.254: v20.57,17.4 21.57,16.4 21.57,14.22 15.6,8.26 9,8.26 v8.74,8
DOWN  (via drill 0.5)
  Top 0.203: 16.2,24.51 v13.08,24.51
  Top 0.254: DOWN.2 3.23,16.44 4.95,18.16 v4.95,19.05 | 16.2,24.51 20.69,29 U3.7
  Bottom 0.254: v4.95,19.05 4.95,21.08 8.38,24.51 v13.08,24.51
G1_3V
  Top 0.254: U3.34 40.7,29 42.53,30.84 44.01,30.84 44.26,31.09 U5.3
G2_3V
  Top 0.254: U3.32 39.67,26.46 43,29.79 U5.5
GND  (via drill 0.5)
  Top 0.305: X5.A1B12 7.52,11.46 8.57,12.51 v10.73,12.51 | R17.1 43.48,35.31 41.97,33.8 C10.1 | U1.19 49.27,24.56 49.1,24.4 49.04,24.4 48.58,23.94 v48.58,22.29 | C7.1 41.02,24.51 | 41.02,24.51 | 41.02,24.51 42.74,26.23 v43.37,26.23 | U2.2 9.27,28.51 C3.1 10.22,28.97 11,28.19 11,23.06 10.79,22.86 | U5.19 51.26,31.74 51.5,31.98 51.67,31.98 51.69,32 51.46,32.24 51.46,32.69 50.68,33.47 v50.1,33.47
  Top 0.406: X5.B1A12 7.64,5.05 9.02,3.68 9.91,3.68 9.93,3.71 CONN1.1 | C10.1 41.81,32.63 C5.1
  other vias: 45.53,22.03 46.29,29.65 48.9,30.04 9.97,18.61 10.48,32.58 12.64,31.81 17.84,30.29 14.92,38.04 10.22,38.42 11.75,38.42 14.29,43.37 6.54,28.89 2.48,32.32 2.6,24.07 2.6,14.67 23.56,36.77 25.34,36.77 27.37,36.77 29.27,36.77 31.05,36.77 33.08,36.77 34.86,36.77 36.64,36.77 37.15,33.97 34.35,34.48 32.45,33.08 30.04,34.73 29.65,32.45 26.23,34.86 26.35,32.7 23.43,34.61 23.43,32.07 25.34,30.29 23.56,28.51 25.34,25.84 23.56,23.94 26.35,22.42 24.57,21.53 29.27,21.4 28.89,23.56 26.61,24.7 31.43,24.96 32.32,22.8 32.07,20.51 34.35,20.38 36.89,20.26 36.39,22.29 34.86,21.78 34.61,24.32 36.39,26.23 33.21,26.86 33.34,29.53 35.75,28 36.39,30.16 34.61,32.19 40.32,36.64 45.02,36.51 52.26,5.52 53.66,8.19 49.85,1.97 46.93,2.1 44.51,6.16 45.66,8.06 17.08,12.64 13.78,9.97 11.62,2.86 11.24,0.95 2.6,6.92 8.7,3.75 40.32,30.67 46.04,24.57 46.42,26.61 34.86,11.87 44.51,14.03 41.21,8.06
  pour Top: 0.06,0.06 63.5,0.06 63.5,44.26 51.88,44.31 51.88,37.91 15.68,37.91 15.68,44.26 0.06,44.26
  pour Bottom: 0.06,0.06 63.5,0.06 63.5,44.26 52.07,44.26 52.07,37.91 15.62,37.91 15.62,44.26 0.06,44.26
INT  (via drill 0.5)
  Top 0.203: 19.1,26.59 15.63,23.11 v13.21,23.11
  Top 0.254: U4.11 v11.43,13.59 | 19.1,26.59 20.25,27.73 U3.8
  Bottom 0.254: v13.21,23.11 11.43,21.34 v11.43,13.59
IO1_DBLTAP
  Top 0.254: U3.39 40.47,35.35 C21.1 R17.2
LAT  (via drill 0.48)
  Top 0.203: JP3.15 v59.18,15.88 57.91,17.14 51.94,17.14 50.88,18.21 50.88,20.5 50.71,20.66 U1.13
  Bottom 0.203: v59.18,15.88 JP3.15
LAT_3V
  Top 0.254: U1.7 43.62,21.31 39.19,16.89 35.31,16.89 34.56,17.64 U3.24
LIGHT  (via drill 0.5)
  Top 0.254: U3.5 19.57,31.54 R2.1 19.52,30.31 v19.43,30.23 | U6.E 1.14,2.3 1.14,13.38 v1.38,13.62
  Bottom 0.254: v19.43,30.23 18.41,29.21 8.38,29.21 3.39,24.21 3.39,18.05 1.38,16.05 v1.38,13.62
M1_A  (via drill 0.48)
  Top 0.203: v55.37,20.95 JP3.12 51.82,20.95 50.81,21.96 U1.15
  Bottom 0.203: JP3.12 v55.37,20.95
M1_B  (via drill 0.48)
  Top 0.203: JP3.11 v59.05,20.95 58.55,20.95 57.15,22.35 51.69,22.35 51.18,22.86 51.18,25.96 U5.11
  Bottom 0.203: JP3.11 v59.05,20.95
M1_B1  (via drill 0.48)
  Top 0.203: U5.16 53.27,29.79 54.15,28.91 JP3.6 v55.5,28.57
  Bottom 0.203: v55.5,28.57 JP3.6
M1_B2  (via drill 0.48)
  Top 0.203: U5.13 50.69,27.76 56.44,27.76 57.15,27.05 57.15,24.51 56.13,23.5 v55.37,23.5 JP3.10
  Bottom 0.203: JP3.10 v55.37,23.5
M1_C  (via drill 0.48)
  Top 0.203: JP3.14 54.23,18.41 | 54.23,18.41 v55.5,18.41 | U1.14 50.8,21.31 51.28,20.83 51.28,20.32 51.53,20.07 52.83,20.07 54.23,18.67 54.23,18.41
  Bottom 0.203: v55.5,18.41 JP3.14
M1_D  (via drill 0.48)
  Top 0.203: JP3.13 v59.05,18.41 58.23,18.41 57.28,19.37 57.28,21.59 57.02,21.85 51.49,21.85 50.73,22.61 U1.16
  Bottom 0.203: JP3.13 v59.05,18.41
M1_E
  Top 0.203: U1.12 50.04,20.01 49.96,19.94 46.93,19.94 44.74,17.75 44.3,17.75 43.31,16.76 SJ1.2
M1_E8  (via drill 0.48, 0.5)
  Top 0.203: v48.77,20.7 47.12,20.7 44.58,18.16 43.31,18.16 41.91,16.76 SJ1.1 | JP3.9 v59.05,23.5
  Bottom 0.203: v48.77,20.7 49.53,21.46 49.53,23.11 47.75,24.89 47.75,26.29 48.77,27.3 49.72,27.3 50.39,26.64 50.39,24.55 51,23.94 51,23.11 52.02,22.1 57.66,22.1 v59.05,23.5 JP3.9
M1_E16  (via drill 0.48)
  Top 0.203: SJ1.3 46.67,13.59 50.29,13.59 51.36,12.52 58.11,12.52 v58.93,13.34 JP3.17
  Bottom 0.203: JP3.17 v58.93,13.34
M1_G1  (via drill 0.48)
  Top 0.203: U5.17 51.38,30.44 51.52,30.3 58.49,30.3 59.31,31.11 | 59.31,31.11 JP3.3 | v58.42,31.11 59.31,31.11
  Bottom 0.203: JP3.3 v58.42,31.11
M1_G2  (via drill 0.48)
  Top 0.203: U5.15 49.55,29.14 v49.45,29.04 | JP3.7 v59.31,26.04
  Bottom 0.203: v49.45,29.04 50.26,29.84 56.52,29.84 57.15,29.21 57.15,27.69 58.8,26.04 v59.31,26.04 JP3.7
M1_R1  (via drill 0.48)
  Top 0.203: U5.18 54.12,31.09 JP3.4 v54.99,31.11
  Bottom 0.203: v54.99,31.11 JP3.4
M1_R2  (via drill 0.48)
  Top 0.203: U5.14 49.97,28.49 49.76,28.29 48.86,28.29 v48.76,28.18 | JP3.8 v53.34,26.04
  Bottom 0.203: v48.76,28.18 50.18,28.18 52.32,26.04 v53.34,26.04 JP3.8
N$1
  Top 0.254: R7.2 6.35,41.49 5.41,42.43 5VON.A
N$2
  Top 0.254: R6.1 8.13,40.97 6.93,42.16 3VON.C
N$3
  Top 0.305: 49.4,10.99 49.66,10.99
N$4
  Top 0.203: 42.42,15.49 42.8,15.49
N$5
  Top 0.254: L.C 33.33,14.95 R3.1
NEOPIX  (via drill 0.5)
  Top 0.254: v13.84,38.99 13.94,39.09 LED1.1 | v19.68,32.77 21.45,32.77 U3.4
  Bottom 0.254: v13.84,38.99 13.59,38.73 13.59,37.59 16.89,34.29 18.16,34.29 v19.68,32.77
OE  (via drill 0.48)
  Top 0.203: JP3.18 v53.21,13.34 52.07,13.34 50.61,14.8 50.61,17.33 49.97,17.97 U1.11
  Bottom 0.203: JP3.18 v53.21,13.34
OE_3V
  Top 0.254: R1.2 39.62,15.93 39.55,15.93 | U3.22 32.02,17.89 33.98,15.93 39.55,15.93 | 39.55,15.93 43.43,19.81 43.64,20.01 U1.9 | U1.9
R1_3V
  Top 0.254: U3.35 39.21,30.27 39.63,29.84 40.86,29.84 42.5,31.48 43.88,31.48 44.14,31.74 U5.2
R2_3V
  Top 0.254: U3.31 38.75,25.15 39.12,25.15 43.11,29.14 U5.6
RXI
  Top 0.254: JP1.7 26.67,5.59 19.58,12.68 19.58,22.23 20.01,22.65 U3.12
SCL  (via drill 0.5)
  Top 0.254: U4.4 15.76,14.09 v16.26,13.59 16.26,10.79 | v17.65,15.75 17.27,16.13 17.27,19.05 18.03,19.81 18.03,22.98 20.25,25.19 U3.10 | 16.26,10.79 16.26,7.87 13.44,5.05 CONN1.4 | R10.8 12.63,10.79 16.26,10.79
  Bottom 0.254: v17.65,15.75 17.65,15.24 16.26,13.84 v16.26,13.59
SDA
  Top 0.254: R10.5 11.93,7.49 CONN1.3 11.93,4.33 12.45,3.81 13.46,3.81 18.03,8.38 18.03,14.1 16.64,15.49 16.51,15.49 | U4.6 14.77,15.49 16.51,15.49 | U3.9 20.88,26.46 17.58,23.16 17.58,20.51 16.51,19.44 16.51,15.49
TXD0  (via drill 0.5)
  Top 0.254: v22.48,6.86 21.59,5.97 JP1.9 | U3.37 40.09,32.81 v40.26,32.64
  Bottom 0.254: v22.48,6.86 23.62,8 34.67,8 46.35,19.68 46.35,23.11 44.78,24.68 44.78,26.97 41.61,30.14 41.61,31.29 v40.26,32.64
TXO
  Top 0.254: JP1.8 24.13,7.24 19.05,12.32 19.05,23.11 19.86,23.92 U3.11
UP  (via drill 0.5)
  Top 0.203: 20.88,30.27 16.51,25.91 v14.22,25.91
  Top 0.254: UP.2 2.81,25.64 4.95,23.5 v5.33,23.5 | 20.88,30.27 U3.6
  Bottom 0.254: v14.22,25.91 8.13,25.91 5.71,23.5 v5.33,23.5
VCC
  Top 0.406: SENSE.2 48.9,10.99 SJ2.2 48.58,11.18 48.58,11.87 48.32,12.13 44.83,12.13 C4.1

### Text on the board
tPlace: Boot
tNames: 1
214bmp: D:/SmartProjects/Snc/a4_bn_logo2.bmp